# Altium schematic sheet 09_Analog.SchDoc
size A4
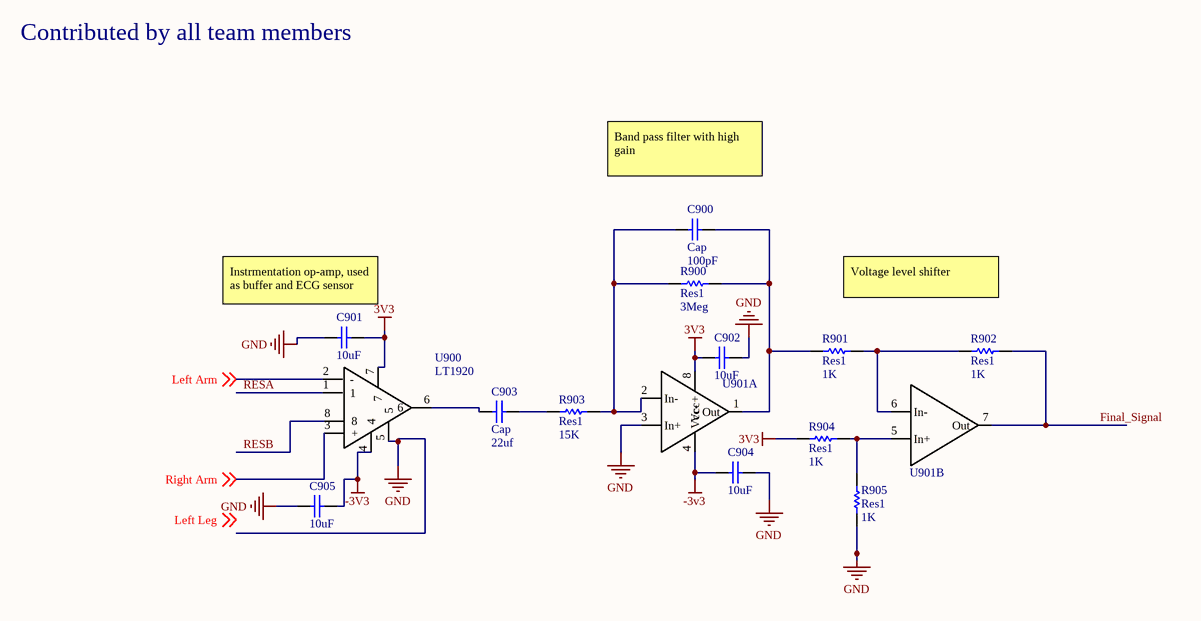
[diagram p0: 09_Analog.SchDoc]

## Parts
C900  Cap  value 100pF  [RAD-0.3]
C901  10uF  [CAP_0805]
C902  10uF  [CAP_0805]
C903  Cap  value 22uf  [RAD-0.3]
C904  10uF  [CAP_0805]
C905  10uF  [CAP_0805]
R900  Res1  value 3Meg  [AXIAL-0.3]
R901  Res1  value 1K  [AXIAL-0.3]
R902  Res1  value 1K  [AXIAL-0.3]
R903  Res1  value 15K  [AXIAL-0.3]
R904  Res1  value 1K  [AXIAL-0.3]
R905  Res1  value 1K  [AXIAL-0.3]
U900  LT1920  [DIP8]
U901  TL072  [DIP8]  (value not drawn)  (parts A,B of 2)

## Nets
3V3: C901.2 C902.1 R904.2 U900.7 U901.8(Vcc+)
-3V3: C904.1 C905.2 U900.4 U901.4(Vcc-)
GND: C901.1 C902.2 C904.2 C905.1 R905.1 U900.5 U901.3(In+)
Final_Signal: R902.1 U901.7(Out)
Left Arm: U900.2(-) ; off-sheet Left Arm
RESA: U900.1
RESB: U900.8
Right Arm: U900.3(+) ; off-sheet Right Arm
NetC900_1: C900.1 R900.2 R903.1 U901.2(In-)
NetC900_2: C900.2 R900.1 R901.2 U901.1(Out)
NetC903_1: C903.1 R903.2
NetC903_2: C903.2 U900.6
NetR901_1: R901.1 R902.2 U901.6(In-)
NetR904_1: R904.1 R905.2 U901.5(In+)

## Notes on the sheet
- Contributed by all team members
- Band pass filter with high gain
- Voltage level shifter
- (near C901) Instrmentation op-amp, used as buffer and ECG sensor
- Labels drawn without touching a wire or pin: Left Leg

## Library data of the parts
C900 C903 = Cap: Capacitor; Published: 8-Jun-2000; LatestRevisionDate: 17-Jul-2002; LatestRevisionNote: Re-released for DXP Platform.; PackageReference: RAD-0.3; Publisher: Altium Limited; PackageDescription: Radial Cap, Thru-Hole; 2 Leads; 0.3 in Pin Spacing
C901 C902 C904 C905 = CAP_0805_U_010.00: CAP CER 10UF 16V X7R 0805; Manufacturer: Samsung; Manufacturer Part Number: CL21A106KPCLQNC; Tolerance: 10%; Voltage Rating: 10V; Dielectric: X5R; ComponentLink3URL: https://datasheet.ciiva.com/26920/getdatasheetpartid-355170-26920201.pdf; ComponentLink3Description: https://datasheet.ciiva.com/26920/getdatasheetpartid-355170-26920201.pdf; Supplier 1: Digi-Key; Stock 1: 40000; Pricing 1: 1=0.22, 10=0.148, 100=0.0749, 500=0.05122, 1000=0.04531 (USD); Mount: Surface Mount; Case/Package: 0805; Case Code (Metric): 2012; Case Code (Imperial): 0805; Contact Plating: Tin; Min Operating Temperature: -55°C; Max Operating Temperature: 85°C; Packaging: Tape and Reel; Package Quantity: 1; Length: 2mm; Height: 0.85mm; Width: 0.049inch; Thickness: 0.037inch; Depth: 1.25mm; Radiation Hardening: No; ComponentLink1URL: https://datasheet.ciiva.com/25730/cl21a106kpclqnc-25730594.pdf; ComponentLink1Description: https://datasheet.ciiva.com/25730/cl21a106kpclqnc-25730594.pdf; Supplier Part Number 1: 1276-2402-1-ND; Capacitance: 10uF
R900-R905 = Res1: Resistor; Published: 8-Jun-2000; LatestRevisionDate: 17-Jul-2002; LatestRevisionNote: Re-released for DXP Platform.; PackageReference: AXIAL-0.3; Publisher: Altium Limited; PackageDescription: Axial Device, Thru-Hole; 2 Leads; 0.3 in Pin Spacing
U901 = TL072: Manufacturer: Texas Instruments; Manufacturer Part Number: TL072IP; Amplifier Type: J-FET; Number of Circuits: 2; Slew Rate: 13 V/µs; Current - Supply: 1.4mA; Voltage - Supply, Single/Dual (±): 7 V ~ 36 V, ±3.5 V ~ 18 V; Supplier 1: Digi-Key; RoHS: RoHS Compliant; Category: Integrated Circuits (ICs); Stock 1: 2537; Pricing 1: 1=0.69, 10=0.607, 100=0.4655, 500=0.368, 1000=0.2944 (USD); Packaging: Tube; Part Status: Active; Output Type: -; -3db Bandwidth: -; Current - Output / Channel: -; Operating Temperature: -40°C ~ 85°C; Mounting Type: Through Hole; Package / Case: 8-DIP (0.300", 7.62mm); Supplier Device Package: 8-PDIP; ComponentLink1URL: http://www.ti.com/lit/ds/symlink/tl071a.pdf; ComponentLink1Description: http://www.ti.com/lit/ds/symlink/tl071a.pdf; Supplier Part Number 1: 296-14997-5-ND
U900 = LT1920: Supplier 1: Digi-Key; Supplier Part Number 1: LT1920CN8#PBF-ND